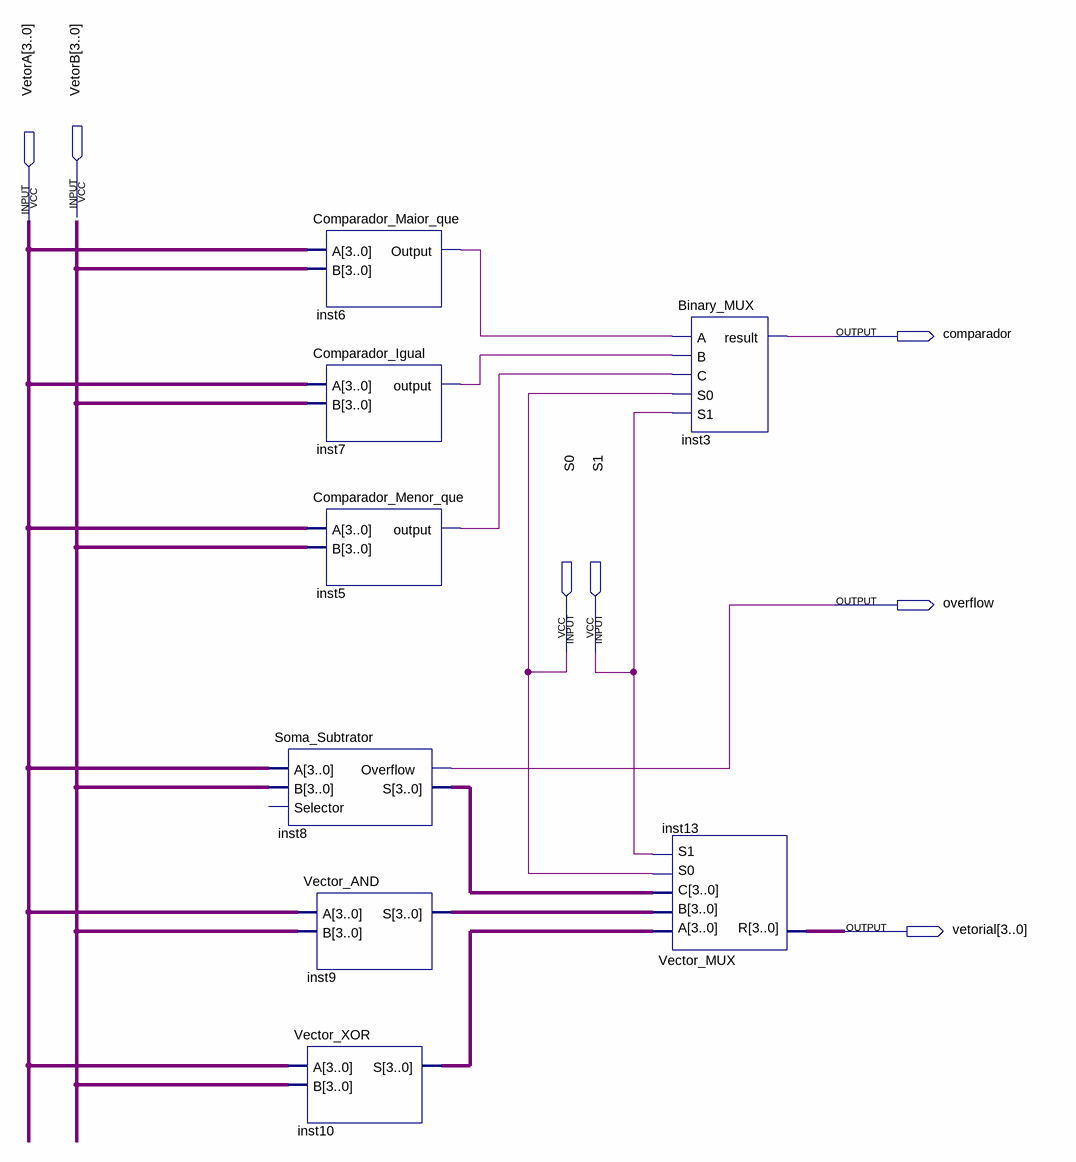
[diagram p0: schematic sheet]
// Quartus schematic ULA.bdf as structural Verilog: 8 symbols, 7 pins
module ULA (
  input  [3:0] VetorA,
  input  [3:0] VetorB,
  input  S0,
  input  S1,
  output comparador,
  output overflow,
  output [3:0] vetorial
);

  wire inst5_output, inst6_output, inst7_output;
  wire [3:0] inst8_s, inst9_s, inst10_s;

  Comparador_Maior_que inst6 (.A(VetorA), .B(VetorB), .Output(inst6_output));
  Comparador_Igual inst7 (.A(VetorA), .B(VetorB), .\output (inst7_output));
  Comparador_Menor_que inst5 (.A(VetorA), .B(VetorB), .\output (inst5_output));
  Soma_Subtrator inst8 (.A(VetorA), .B(VetorB), .Overflow(overflow), .S(inst8_s));  // open: Selector
  Vector_AND inst9 (.A(VetorA), .B(VetorB), .S(inst9_s));
  Vector_XOR inst10 (.A(VetorA), .B(VetorB), .S(inst10_s));
  Binary_MUX inst3 (.A(inst6_output), .B(inst7_output), .C(inst5_output), .S0(S0), .S1(S1), .result(comparador));
  Vector_MUX inst13 (.A(inst10_s), .B(inst9_s), .C(inst8_s), .S0(S0), .S1(S1), .R(vetorial));
endmodule
